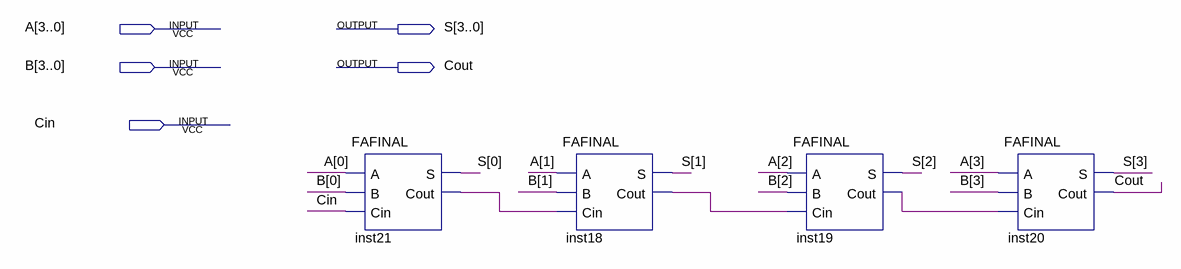
[diagram p0: schematic sheet]
// Quartus schematic lab01.bdf as structural Verilog: 4 symbols, 5 pins
module lab01 (
  input  [3:0] A,
  input  [3:0] B,
  input  Cin,
  output [3:0] S,
  output Cout
);

  wire inst18_cout, inst19_cout, inst21_cout;

  FAFINAL inst21 (.A(A[0]), .B(B[0]), .Cin(Cin), .S(S[0]), .Cout(inst21_cout));
  FAFINAL inst18 (.A(A[1]), .B(B[1]), .Cin(inst21_cout), .S(S[1]), .Cout(inst18_cout));
  FAFINAL inst19 (.A(A[2]), .B(B[2]), .Cin(inst18_cout), .S(S[2]), .Cout(inst19_cout));
  FAFINAL inst20 (.A(A[3]), .B(B[3]), .Cin(inst19_cout), .S(S[3]), .Cout(Cout));
endmodule
